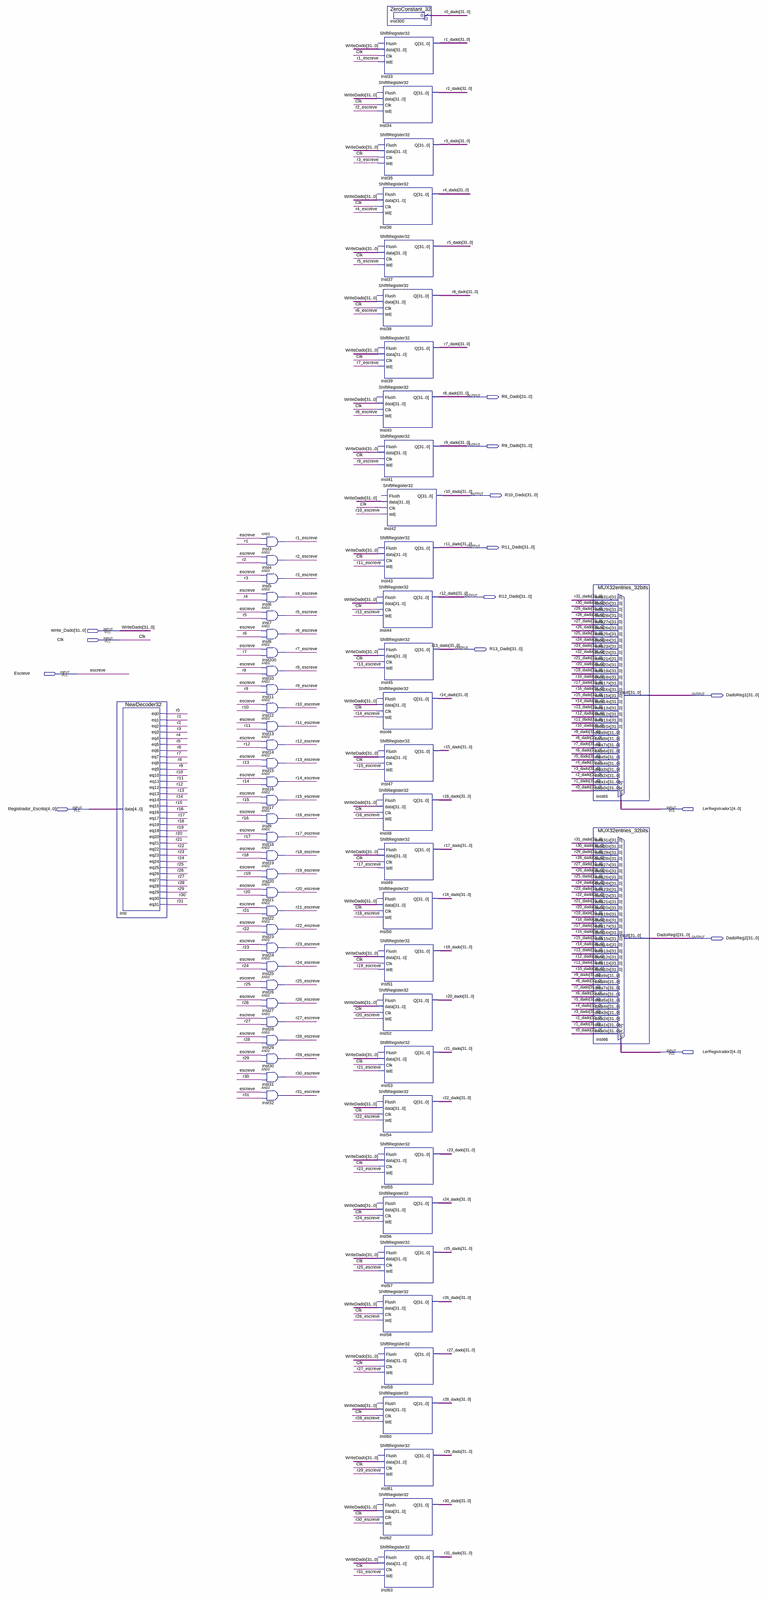
[diagram p0: schematic sheet, whole]
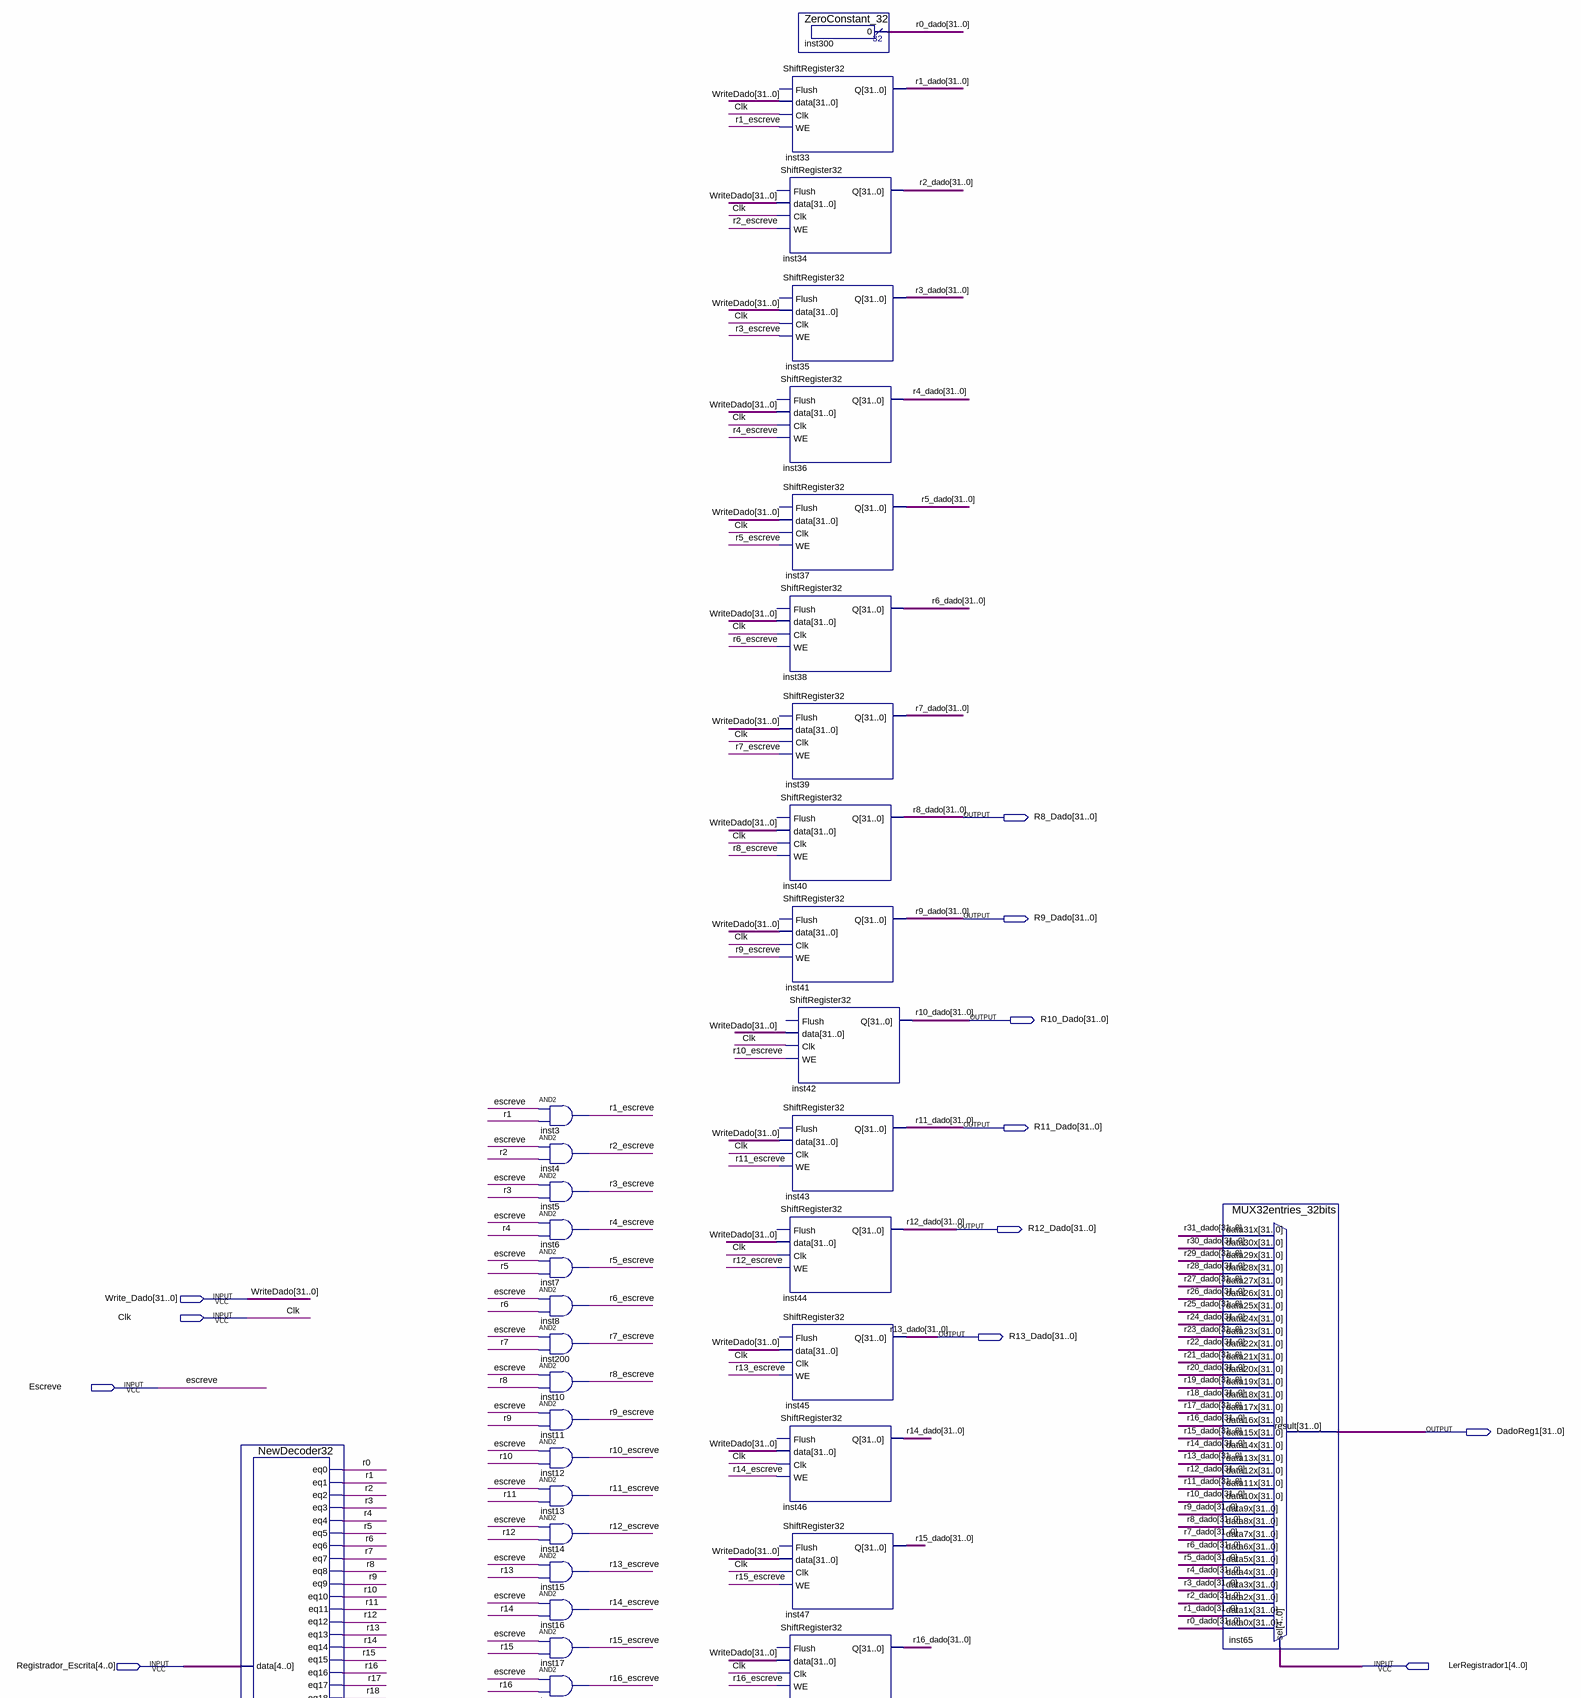
[diagram p1: schematic sheet, upper part]
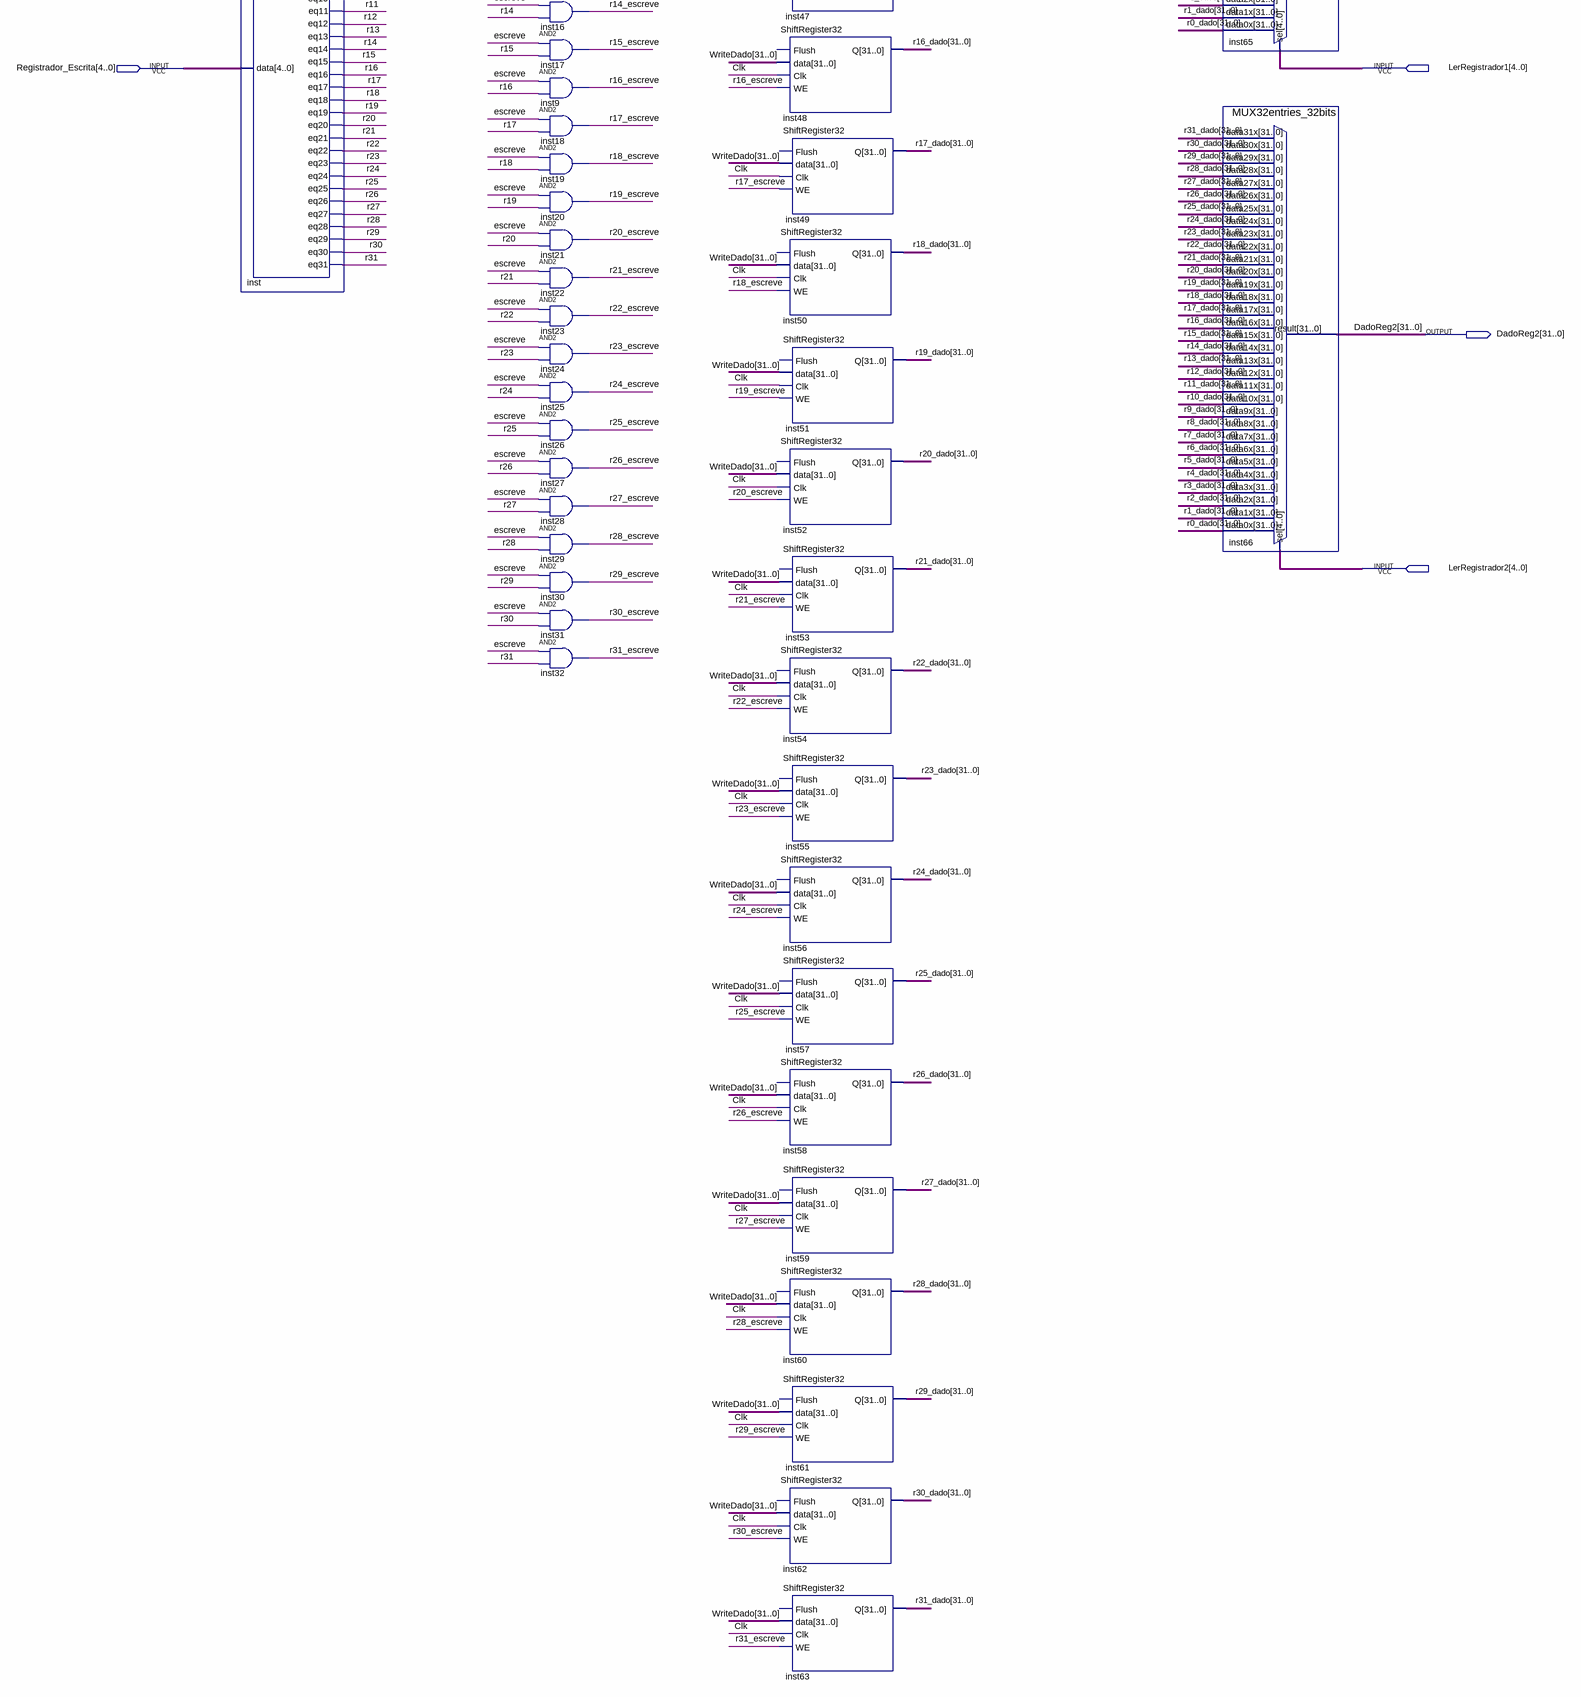
[diagram p2: schematic sheet, lower part]
// Quartus schematic NovoBancoDeRegistradores.bdf as structural Verilog: 66 symbols, 14 pins
module NovoBancoDeRegistradores (
  input  [31:0] Write_Dado,
  input  Clk,
  input  Escreve,
  input  [4:0] Registrador_Escrita,
  input  [4:0] LerRegistrador1,
  input  [4:0] LerRegistrador2,
  output [31:0] R8_Dado,
  output [31:0] R9_Dado,
  output [31:0] R10_Dado,
  output [31:0] R11_Dado,
  output [31:0] R12_Dado,
  output [31:0] R13_Dado,
  output [31:0] DadoReg1,
  output [31:0] DadoReg2
);

  wire r0, r1, r1_escreve, r2, r2_escreve, r3, r3_escreve, r4, r4_escreve, r5, r5_escreve, r6, r6_escreve,
       r7, r7_escreve, r8, r8_escreve, r9, r9_escreve, r10, r10_escreve, r11, r11_escreve, r12, r12_escreve,
       r13, r13_escreve, r14, r14_escreve, r15, r15_escreve, r16, r16_escreve, r17, r17_escreve, r18,
       r18_escreve, r19, r19_escreve, r20, r20_escreve, r21, r21_escreve, r22, r22_escreve, r23, r23_escreve,
       r24, r24_escreve, r25, r25_escreve, r26, r26_escreve, r27, r27_escreve, r28, r28_escreve, r29,
       r29_escreve, r30, r30_escreve, r31, r31_escreve;
  wire [31:0] r0_dado, r1_dado, r2_dado, r3_dado, r4_dado, r5_dado, r6_dado, r7_dado, r14_dado, r15_dado,
       r16_dado, r17_dado, r18_dado, r19_dado, r20_dado, r21_dado, r22_dado, r23_dado, r24_dado, r25_dado,
       r26_dado, r27_dado, r28_dado, r29_dado, r30_dado, r31_dado;

  NewDecoder32 inst (
    .data(Registrador_Escrita), .eq0(r0), .eq1(r1), .eq2(r2), .eq3(r3), .eq4(r4), .eq5(r5), .eq6(r6),
    .eq7(r7), .eq8(r8), .eq9(r9), .eq10(r10), .eq11(r11), .eq12(r12), .eq13(r13), .eq14(r14), .eq15(r15),
    .eq16(r16), .eq17(r17), .eq18(r18), .eq19(r19), .eq20(r20), .eq21(r21), .eq22(r22), .eq23(r23),
    .eq24(r24), .eq25(r25), .eq26(r26), .eq27(r27), .eq28(r28), .eq29(r29), .eq30(r30), .eq31(r31));
  and inst3 (r1_escreve, Escreve, r1);
  and inst4 (r2_escreve, Escreve, r2);
  and inst5 (r3_escreve, Escreve, r3);
  and inst6 (r4_escreve, Escreve, r4);
  and inst7 (r5_escreve, Escreve, r5);
  and inst8 (r6_escreve, Escreve, r6);
  and inst200 (r7_escreve, Escreve, r7);
  and inst10 (r8_escreve, Escreve, r8);
  and inst11 (r9_escreve, Escreve, r9);
  and inst12 (r10_escreve, Escreve, r10);
  and inst13 (r11_escreve, Escreve, r11);
  and inst14 (r12_escreve, Escreve, r12);
  and inst15 (r13_escreve, Escreve, r13);
  and inst16 (r14_escreve, Escreve, r14);
  and inst17 (r15_escreve, Escreve, r15);
  and inst9 (r16_escreve, Escreve, r16);
  and inst18 (r17_escreve, Escreve, r17);
  and inst19 (r18_escreve, Escreve, r18);
  and inst20 (r19_escreve, Escreve, r19);
  and inst21 (r20_escreve, Escreve, r20);
  and inst22 (r21_escreve, Escreve, r21);
  and inst23 (r22_escreve, Escreve, r22);
  and inst24 (r23_escreve, Escreve, r23);
  and inst25 (r24_escreve, Escreve, r24);
  and inst26 (r25_escreve, Escreve, r25);
  and inst27 (r26_escreve, Escreve, r26);
  and inst28 (r27_escreve, Escreve, r27);
  and inst29 (r28_escreve, Escreve, r28);
  and inst30 (r29_escreve, Escreve, r29);
  and inst31 (r30_escreve, Escreve, r30);
  and inst32 (r31_escreve, Escreve, r31);
  ShiftRegister32 inst33 (.data(Write_Dado), .Clk(Clk), .WE(r1_escreve), .Q(r1_dado));  // open: Flush
  ShiftRegister32 inst34 (.data(Write_Dado), .Clk(Clk), .WE(r2_escreve), .Q(r2_dado));  // open: Flush
  ShiftRegister32 inst35 (.data(Write_Dado), .Clk(Clk), .WE(r3_escreve), .Q(r3_dado));  // open: Flush
  ShiftRegister32 inst36 (.data(Write_Dado), .Clk(Clk), .WE(r4_escreve), .Q(r4_dado));  // open: Flush
  ShiftRegister32 inst37 (.data(Write_Dado), .Clk(Clk), .WE(r5_escreve), .Q(r5_dado));  // open: Flush
  ShiftRegister32 inst38 (.data(Write_Dado), .Clk(Clk), .WE(r6_escreve), .Q(r6_dado));  // open: Flush
  ShiftRegister32 inst39 (.data(Write_Dado), .Clk(Clk), .WE(r7_escreve), .Q(r7_dado));  // open: Flush
  ShiftRegister32 inst40 (.data(Write_Dado), .Clk(Clk), .WE(r8_escreve), .Q(R8_Dado));  // open: Flush
  ShiftRegister32 inst41 (.data(Write_Dado), .Clk(Clk), .WE(r9_escreve), .Q(R9_Dado));  // open: Flush
  ShiftRegister32 inst43 (.data(Write_Dado), .Clk(Clk), .WE(r11_escreve), .Q(R11_Dado));  // open: Flush
  ShiftRegister32 inst44 (.data(Write_Dado), .Clk(Clk), .WE(r12_escreve), .Q(R12_Dado));  // open: Flush
  ShiftRegister32 inst45 (.data(Write_Dado), .Clk(Clk), .WE(r13_escreve), .Q(R13_Dado));  // open: Flush
  ShiftRegister32 inst46 (.data(Write_Dado), .Clk(Clk), .WE(r14_escreve), .Q(r14_dado));  // open: Flush
  ShiftRegister32 inst47 (.data(Write_Dado), .Clk(Clk), .WE(r15_escreve), .Q(r15_dado));  // open: Flush
  ShiftRegister32 inst48 (.data(Write_Dado), .Clk(Clk), .WE(r16_escreve), .Q(r16_dado));  // open: Flush
  ShiftRegister32 inst49 (.data(Write_Dado), .Clk(Clk), .WE(r17_escreve), .Q(r17_dado));  // open: Flush
  ShiftRegister32 inst50 (.data(Write_Dado), .Clk(Clk), .WE(r18_escreve), .Q(r18_dado));  // open: Flush
  ShiftRegister32 inst51 (.data(Write_Dado), .Clk(Clk), .WE(r19_escreve), .Q(r19_dado));  // open: Flush
  ShiftRegister32 inst52 (.data(Write_Dado), .Clk(Clk), .WE(r20_escreve), .Q(r20_dado));  // open: Flush
  ShiftRegister32 inst53 (.data(Write_Dado), .Clk(Clk), .WE(r21_escreve), .Q(r21_dado));  // open: Flush
  ShiftRegister32 inst54 (.data(Write_Dado), .Clk(Clk), .WE(r22_escreve), .Q(r22_dado));  // open: Flush
  ShiftRegister32 inst55 (.data(Write_Dado), .Clk(Clk), .WE(r23_escreve), .Q(r23_dado));  // open: Flush
  ShiftRegister32 inst56 (.data(Write_Dado), .Clk(Clk), .WE(r24_escreve), .Q(r24_dado));  // open: Flush
  ShiftRegister32 inst57 (.data(Write_Dado), .Clk(Clk), .WE(r25_escreve), .Q(r25_dado));  // open: Flush
  ShiftRegister32 inst58 (.data(Write_Dado), .Clk(Clk), .WE(r26_escreve), .Q(r26_dado));  // open: Flush
  ShiftRegister32 inst59 (.data(Write_Dado), .Clk(Clk), .WE(r27_escreve), .Q(r27_dado));  // open: Flush
  ShiftRegister32 inst60 (.data(Write_Dado), .Clk(Clk), .WE(r28_escreve), .Q(r28_dado));  // open: Flush
  ShiftRegister32 inst61 (.data(Write_Dado), .Clk(Clk), .WE(r29_escreve), .Q(r29_dado));  // open: Flush
  ShiftRegister32 inst62 (.data(Write_Dado), .Clk(Clk), .WE(r30_escreve), .Q(r30_dado));  // open: Flush
  ShiftRegister32 inst63 (.data(Write_Dado), .Clk(Clk), .WE(r31_escreve), .Q(r31_dado));  // open: Flush
  ZeroConstant_32 inst300 (.result(r0_dado));
  ShiftRegister32 inst42 (.data(Write_Dado), .Clk(Clk), .WE(r10_escreve), .Q(R10_Dado));  // open: Flush
  MUX32entries_32bits inst65 (
    .data31x(r31_dado), .data30x(r30_dado), .data29x(r29_dado), .data28x(r28_dado), .data27x(r27_dado),
    .data26x(r26_dado), .data25x(r25_dado), .data24x(r24_dado), .data23x(r23_dado), .data22x(r22_dado),
    .data21x(r21_dado), .data20x(r20_dado), .data19x(r19_dado), .data18x(r18_dado), .data17x(r17_dado),
    .data16x(r16_dado), .data15x(r15_dado), .data14x(r14_dado), .data13x(R13_Dado), .data12x(R12_Dado),
    .data11x(R11_Dado), .data10x(R10_Dado), .data9x(R9_Dado), .data8x(R8_Dado), .data7x(r7_dado),
    .data6x(r6_dado), .data5x(r5_dado), .data4x(r4_dado), .data3x(r3_dado), .data2x(r2_dado),
    .data1x(r1_dado), .data0x(r0_dado), .sel(LerRegistrador1), .result(DadoReg1));
  MUX32entries_32bits inst66 (
    .data31x(r31_dado), .data30x(r30_dado), .data29x(r29_dado), .data28x(r28_dado), .data27x(r27_dado),
    .data26x(r26_dado), .data25x(r25_dado), .data24x(r24_dado), .data23x(r23_dado), .data22x(r22_dado),
    .data21x(r21_dado), .data20x(r20_dado), .data19x(r19_dado), .data18x(r18_dado), .data17x(r17_dado),
    .data16x(r16_dado), .data15x(r15_dado), .data14x(r14_dado), .data13x(R13_Dado), .data12x(R12_Dado),
    .data11x(R11_Dado), .data10x(R10_Dado), .data9x(R9_Dado), .data8x(R8_Dado), .data7x(r7_dado),
    .data6x(r6_dado), .data5x(r5_dado), .data4x(r4_dado), .data3x(r3_dado), .data2x(r2_dado),
    .data1x(r1_dado), .data0x(r0_dado), .sel(LerRegistrador2), .result(DadoReg2));

  // Other names for the same wires on the sheet: WriteDado[31:0] = Write_Dado
endmodule
